# Altium schematic sheet golden_arduino.SchDoc: Golden Arduino Board
size A4; DrawnBy: Rajat Chaple; Revision: 0.0.1; SheetNumber: 1; SheetTotal: 1
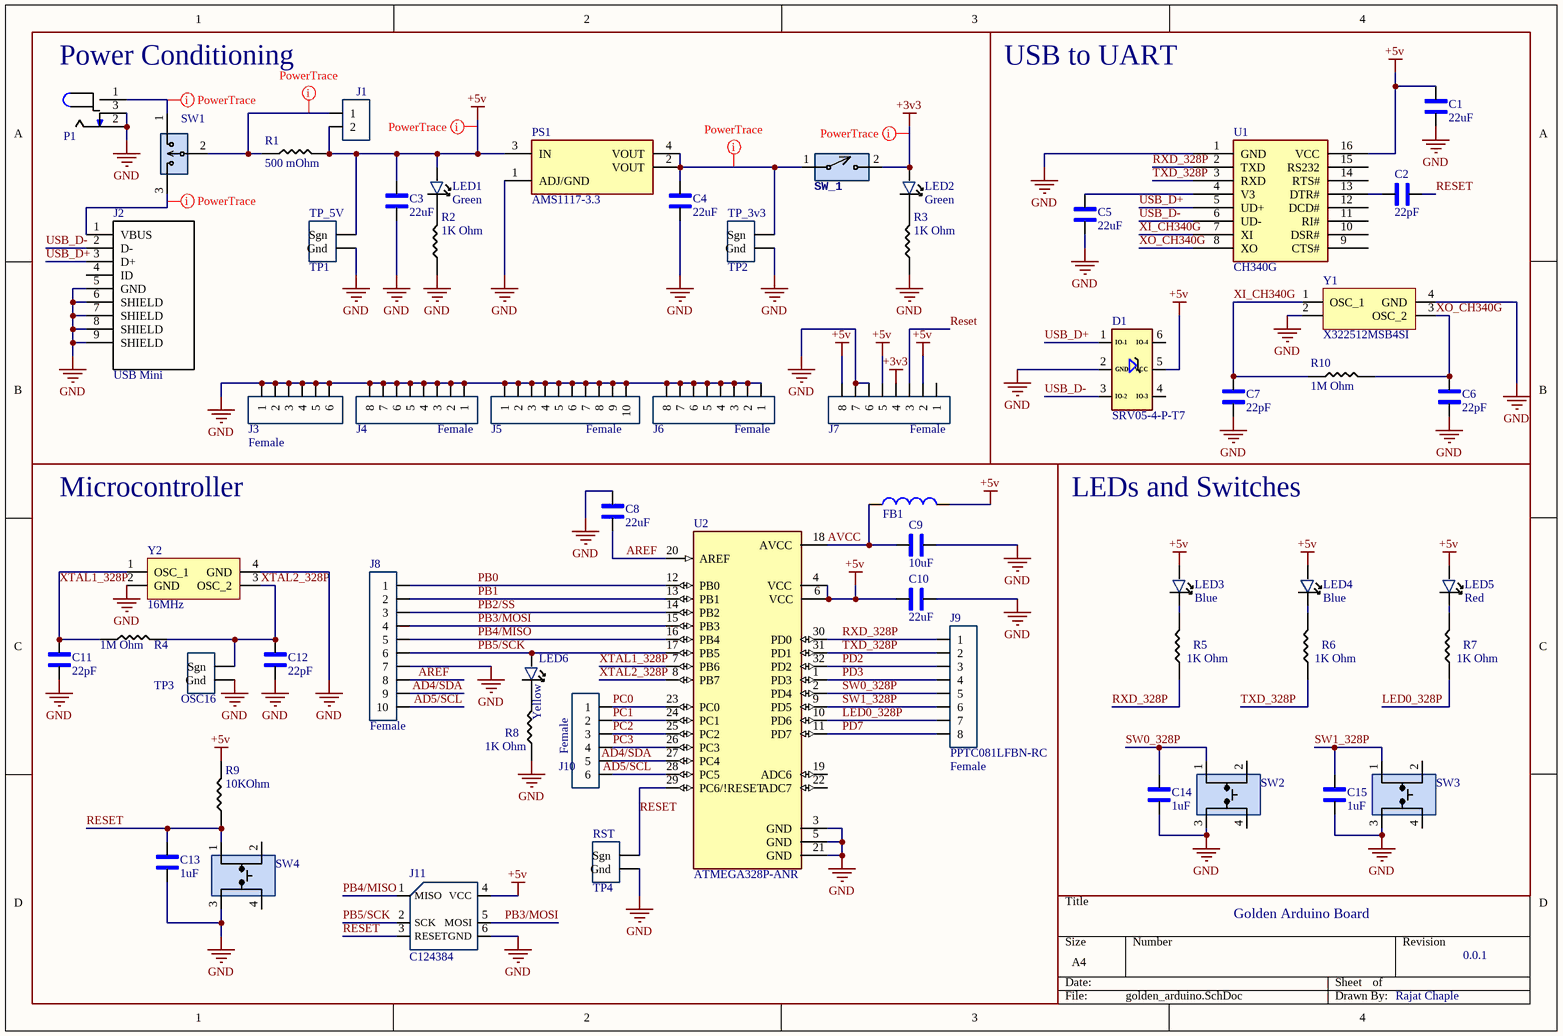
[diagram p0: golden_arduino.SchDoc]

## Parts
C1  22uF  [0805_Passive_Capaciitor]
C2  22pF  [0402_Passive_Capacitor]
C3  22uF  [0805_Passive_Capaciitor]
C4  22uF  [0805_Passive_Capaciitor]
C5  22uF  [0805_Passive_Capaciitor]
C6  22pF  [0402_Passive_Capacitor]
C7  22pF  [0402_Passive_Capacitor]
C8  22uF  [0805_Passive_Capaciitor]
C9  10uF  [0402_Passive_Capacitor]
C10  22uF  [0805_Passive_Capaciitor]
C11  22pF  [0402_Passive_Capacitor]
C12  22pF  [0402_Passive_Capacitor]
C13  1uF  [0402_Passive_Capacitor]
C14  1uF  [0402_Passive_Capacitor]
C15  1uF  [0402_Passive_Capacitor]
D1  SRV05-4-P-T7  [TVS]
FB1  FB_10uH_0603  [0603_PASSIVE_Capacitor]  (value not drawn)
J1  J_2_PIN_HEADER  [2_PIN_100MIL]  (value not drawn)
J2  USB Mini  [USB_MINI_B]
J3  value Female  [6_PIN_ARDUINO_100mil]  (hidden comment: PPTC061LFBN-RC)
J4  value Female  [8_PIN_ARDUINO_100MIL]  (hidden comment: PPTC081LFBN-RC)
J5  value Female  [10_PIN_ARDUINO_100MIL]  (hidden comment: PPTC101LFBN-RC)
J6  value Female  [8_PIN_ARDUINO_100MIL]  (hidden comment: PPTC081LFBN-RC)
J7  value Female  [8_PIN_ARDUINO_100MIL]  (hidden comment: PPTC081LFBN-RC)
J8  value Female  [10_PIN_ARDUINO_100MIL]  (hidden comment: PPTC101LFBN-RC)
J9  PPTC081LFBN-RC  value Female  [8_PIN_ARDUINO_100MIL]
J10  value Female  [6_PIN_ARDUINO_100mil]  (hidden comment: PPTC061LFBN-RC)
J11  LCSC Part#: C124384  [ICSP]  (hidden comment: NRPN032PAEN-RC)
LED1  value Green  [LED_0603]  (hidden comment: KT-0603R)
LED2  value Green  [LED_0603]  (hidden comment: KT-0603R)
LED3  value Blue  [LED_0603]  (hidden comment: KT-0603R)
LED4  value Blue  [LED_0603]  (hidden comment: KT-0603R)
LED5  value Red  [LED_0603]  (hidden comment: KT-0603R)
LED6  value Yellow  [LED_0603]  (hidden comment: KT-0603R)
P1  Power Jack  [Power_Jack]  (value not drawn)
PS1  AMS1117-3.3  [LDO]
R1  value 500 mOhm  [1206_Passive_Resitor]  (hidden comment: 500m)
R2  value 1K Ohm  [0805_Passive_Resistor]  (hidden comment: 1k)
R3  value 1K Ohm  [0805_Passive_Resistor]  (hidden comment: 1k)
R4  value 1M Ohm  [1206_Passive_Resitor]  (hidden comment: 1M)
R5  value 1K Ohm  [0805_Passive_Resistor]  (hidden comment: 1k)
R6  value 1K Ohm  [0805_Passive_Resistor]  (hidden comment: 1k)
R7  value 1K Ohm  [0805_Passive_Resistor]  (hidden comment: 1k)
R8  value 1K Ohm  [0805_Passive_Resistor]  (hidden comment: 1k)
R9  value 10KOhm  [0402_Passive_Resistor]  (hidden comment: 10k)
R10  value 1M Ohm  [1206_Passive_Resitor]  (hidden comment: 1M)
SW1  PREC003SAAN-RC  [3_PIN_100mil]  (value not drawn)
SW2  TL3305AF160QG  [Switch_JLC]  (value not drawn)
SW3  TL3305AF160QG  [Switch_JLC]  (value not drawn)
SW4  TL3305AF160QG  [Switch_JLC]  (value not drawn)
SW_1  SW_2Pin_100mil_Switch  [2Pin-Header-Conn]  (value not drawn)
TP1  TP_5V  [TP10x_Probe]
TP2  TP_3v3  [TP10x_Probe]
TP3  OSC16  [TP10x_Probe]
TP4  RST  [TP10x_Probe]
U1  CH340G  [USB to serial]
U2  ATMEGA328P-ANR  [ATMega328P]
Y1  X322512MSB4SI  [Crystal resonator]
Y2  value 16MHz  [Crystal resonator]  (hidden comment: X322516MLB4SI)

## Blocks framed on the sheet
Power Conditioning: C3 C4 J1-J7 LED1 LED2 P1 PS1 R1-R3 SW1 SW_1 TP1 TP2
USB to UART: C1 C2 C5-C7 D1 R10 U1 Y1
Microcontroller: C8-C13 FB1 J8-J11 LED6 R4 R8 R9 SW4 TP3 TP4 U2 Y2
LEDs and Switches: C14 C15 LED3-LED5 R5-R7 SW2 SW3

## Nets
+3v3: J7.4 LED2.1 SW_1.2
+5v: C1.2 C3.2 C10.2 D1.5(VCC) FB1.2 J1.2 J7.2 J7.5 J7.8 J11.4(VCC) LED1.1 LED3.1 LED4.1 LED5.1 PS1.3(IN) R1.2 R9.2 TP1.1(Sgn) U1.16(VCC) U2.4(VCC) U2.6(VCC)
GND: C1.1 C3.1 C4.1 C5.1 C6.1 C7.1 C8.2 C9.1 C10.1 C11.1 C12.1 C13.1 C14.1 C15.1 D1.2(GND) J2.5(GND) J2.6(SHIELD) J2.7(SHIELD) J2.8(SHIELD) J2.9(SHIELD) J3.1 J3.2 J3.3 J3.4 J3.5 J3.6 J4.1 J4.2 J4.3 J4.4 J4.5 J4.6 J4.7 J4.8 J5.1 J5.2 J5.3 J5.4 J5.5 J5.6 J5.7 J5.8 J5.9 J5.10 J6.1 J6.2 J6.3 J6.4 J6.5 J6.6 J6.7 J6.8 J7.6 J7.7 J8.7 J11.6(GND) P1.2 P1.3 PS1.1(ADJ/GND) R2.1 R3.1 R8.1 SW2.3 SW3.3 SW4.3 TP1.2(Gnd) TP2.2(Gnd) TP3.2(Gnd) TP4.2(Gnd) U1.1(GND) U2.3(GND) U2.5(GND) U2.21(GND) Y1.2 Y1.4(GND) Y2.2(GND) Y2.4(GND)
AD4/SDA: J8.9 J10.5 U2.27(PC4)
AD5/SCL: J8.10 J10.6 U2.28(PC5)
AREF: C8.1 J8.8 U2.20(AREF)
AVCC: C9.2 FB1.1 U2.18(AVCC)
LED0_328P: J9.7 R7.1 U2.10(PD6)
PB0: J8.1 U2.12(PB0)
PB1: J8.2 U2.13(PB1)
PB2/SS: J8.3 U2.14(PB2)
PB3/MOSI: J8.4 J11.5(MOSI) U2.15(PB3)
PB4/MISO: J8.5 J11.1(MISO) U2.16(PB4)
PB5/SCK: J8.6 J11.2(SCK) LED6.1 U2.17(PB5)
PC0: J10.1 U2.23(PC0)
PC1: J10.2 U2.24(PC1)
PC2: J10.3 U2.25(PC2)
PC3: J10.4 U2.26(PC3)
PD2: J9.3 U2.32(PD2)
PD3: J9.4 U2.1(PD3)
PD7: J9.8 U2.11(PD7)
RESET: C2.2 C13.2 J7.3 J11.3(RESET) R9.1 SW4.1 TP4.1(Sgn) U2.29(PC6/!RESET)
RXD_328P: J9.1 R5.1 U1.2(TXD) U2.30(PD0)
SW0_328P: C14.2 J9.5 SW2.1 U2.2(PD4)
SW1_328P: C15.2 J9.6 SW3.1 U2.9(PD5)
TXD_328P: J9.2 R6.1 U1.3(RXD) U2.31(PD1)
USB_D+: D1.1(IO-1) J2.3(D+) U1.5(UD+)
USB_D-: D1.3(IO-2) J2.2(D-) U1.6(UD-)
XI_CH340G: C7.2 R10.1 U1.7(XI) Y1.1(OSC_1)
XO_CH340G: C6.2 R10.2 U1.8(XO) Y1.3(OSC_2)
XTAL1_328P: C11.2 R4.1 U2.7(PB6) Y2.1(OSC_1)
XTAL2_328P: C12.2 R4.2 TP3.1(Sgn) U2.8(PB7) Y2.3(OSC_2)
NetC2_1: C2.1 U1.13(DTR#)
NetC4_2: C4.2 PS1.2(VOUT) PS1.4(VOUT) SW_1.1 TP2.1(Sgn)
NetC5_2: C5.2 U1.4(V3)
NetJ1_1: J1.1 R1.1 SW1.2
NetJ2_1: J2.1(VBUS) SW1.3
NetLED1_2: LED1.2 R2.2
NetLED2_2: LED2.2 R3.2
NetLED3_2: LED3.2 R5.2
NetLED4_2: LED4.2 R6.2
NetLED5_2: LED5.2 R7.2
NetLED6_2: LED6.2 R8.2
NetP1_1: P1.1 SW1.1

Not connected (* = marked no-connect by the designer): D1 4(IO-3) 6(IO-4); J2 4(ID); J7 1; SW2 2 4; SW3 2 4; SW4 2 4; U1 9(CTS#) 10(DSR#) 11(RI#) 12(DCD#) 14(RTS#) 15(RS232); U2 19(ADC6) 22(ADC7)

## Layout directives
rule Width Constraint [Pref Width = 20mil    Min Width = 10mil    Max Width = 100mil]: +3v3, +5v, NetC4_2, NetJ1_1, NetJ2_1, NetP1_1

## Library data of the parts
C1 C3-C5 C8 C10 = C_22uF_0805: MULTILAYER CERAMIC CAPACITORS MLCC - SMD/SMT 22UF 25V 0805 ROHS; MFR Part #: CL21A226MAQNNNE; Type: Basic; Datasheet: https://datasheet.lcsc.com/szlcsc/Samsung-Electro-Mechanics-CL21A226MAQNNNE_C45783.pdf; LCSC Part#: C45783; Value: 22uF
C2 C6 C7 C11 C12 = C_22pF_0402: MULTILAYER CERAMIC CAPACITORS MLCC - SMD/SMT 22PF 50V 0402 ROHS; MFR Part #: 0402CG220J500NT; Type: Basic; Datasheet: https://datasheet.lcsc.com/szlcsc/Guangdong-Fenghua-Advanced-Tech-0402CG220J500NT_C1555.pdf; LCSC Part#: C1555; Value: 22pF
C9 = C_10uF_0402: 10uF ±20% 6.3V X5R 0402 Multilayer Ceramic Capacitors MLCC - SMD/SMT RoHS; MFR Part #: CL05A106MQ5NUNC; Type: Basic; LCSC Part#: C15525; Datasheet: https://datasheet.lcsc.com/lcsc/1810191215_Samsung-Electro-Mechanics-CL05A106MQ5NUNC_C15525.pdf; Value: 10uF
C13-C15 = C_1uF_0402: MULTILAYER CERAMIC CAPACITORS MLCC - SMD/SMT 1UF 25V 0402 ROHS; MFR Part #: CL05A105KA5NQNC; Type: Basic; Datasheet: https://datasheet.lcsc.com/szlcsc/Samsung-Electro-Mechanics-CL05A105KA5NQNC_C52923.pdf; LCSC Part#: C52923; Value: 1uF
D1 = D_TVS_Diode: TVS SOT-23-6 ROHS; Value: TVS DIODE 5.5V 6TSOP; Type: Basic; MFR Part #: SRV05-4-P-T7; LCSC Part#: C85364; Datasheet: https://datasheet.lcsc.com/szlcsc/ProTek-Devices-SRV05-4-P-T7_C85364.pdf
FB1 = FB_10uH_0603: 10 uH, 30 Q, 1.85 Ohm Series Resistance, 17MHz Self Resonant Frequency,Inductor , SMD 0603, 3 Amps rated current; MFR Part #: SDFL1608S100KTF; Type: Basic; Datasheet: https://datasheet.lcsc.com/szlcsc/Sunlord-SDFL1608S100KTF_C1035.pdf; LCSC Part#: C1035
J1 = J_2_PIN_HEADER: 2 Position Header Connector 0.100" (2.54mm) Through Hole Tin
J2 = J_USB_B_Mini: Through Hole USB Connectors RoHS; MFR Part #: 920-462A2021D10102; Value: USB mini B; LCSC Part#: C46398; Datasheet: https://datasheet.lcsc.com/szlcsc/2103081233_Jing-Extension-of-the-Electronic-Co-920-462A2021D10102_C46398.pdf; Type: Extended
J3 J10 = JF_6_PIN_FEMALE_ARDUINO: 6 Position Header Connector 0.100" (2.54mm) Through Hole Tin; Digikey Link: https://www.digikey.com/product-detail/en/PPTC061LFBN-RC/S7004-ND/810145/?itemSeq=304982353; Digikey Part: S7004-ND; LCSC Part#: C40877; Type: Extended
J4 J6 J7 J9 = JF_8_PIN_FEMALE_ARDUINO: 8 Position Header Connector 0.100" (2.54mm) Through Hole Tin; Digikey Link: https://www.digikey.com/product-detail/en/PPTC081LFBN-RC/S7006-ND/810147/?itemSeq=304982354; Digikey Part: S7006-ND; Type: Extended; LCSC Part#: C27438
J5 J8 = JF_10_PIN_FEMALE_ARDUINO: 10 Position Header Connector 0.100" (2.54mm) Through Hole Tin; Digikey Link: https://www.digikey.com/product-detail/en/PPTC101LFBN-RC/S7008-ND/810149/?itemSeq=304982352; Digikey Part: S7008-ND; LCSC Part#: C225507; Type: Extended
J11 = J_ICSP: Connector Header Through Hole 6 position 0.079" (2.00mm); Digikey Link: https://www.digikey.com/product-detail/en/NRPN032PAEN-RC/S5801-03-ND/804955/?itemSeq=304982355; Digikey Part: S5801-03-ND; Value: NRPN032PAEN-RC; Type: Extended
LED1 LED2 = LED_GREEN_0603: LIGHT EMITTING DIODES (LED) GREEN 520~535NM 112~258MCD@20MA TOP VIEW 0603 ROHS; MFR Part #: 19-217/GHC-YR1S2/3T; Type: Basic; LCSC Part#: C72043
LED3 LED4 = LED_BLUE_0603: LIGHT EMITTING DIODES (LED) BLUE 465~475NM 11.5~28.5MCD@5MA TOP VIEW 0603 ROHS; MFR Part #: 19-217/BHC-ZL1M2RY/3T; Type: Basic; LCSC Part#: C72041
LED5 = LED_RED_0603: LIGHT EMITTING DIODES (LED) RED 520~625NM 90~100MCD@20MA TOP VIEW 0603 ROHS; Type: Basic; Datasheet: https://datasheet.lcsc.com/szlcsc/Everlight-Elec-19-217-BHC-ZL1M2RY-3T_C72041.pdf; MFR Part #: KT-0603R; LCSC Part#: C2286
LED6 = LED_YELLOW_0603: LIGHT EMITTING DIODES (LED) YELLOW 585.5~591.5NM 90~180MCD@20MA TOP VIEW 0603 ROHS; MFR Part #: 19-213/Y2C-CQ2R2L/3T(CY); Type: Basic; Datasheet: https://datasheet.lcsc.com/szlcsc/Everlight-Elec-19-217-BHC-ZL1M2RY-3T_C72041.pdf; LCSC Part#: C72038
P1 = P_Power Jack: Power Barrel Connector Jack 2.10mm ID (0.083"), 5.50mm OD (0.217") Through Hole, Right Angle; Value: CONN PWR JACK 2X5.5MM SOLDER; Digikey Link: https://www.digikey.com/product-detail/en/PJ-102A/CP-102A-ND/275425/?itemSeq=304982367; Digikey Part: CP-102A-ND; LCSC Part#: C136744; Type: Extended
PS1 = PS_AMS_LDO_3v3: LOW DROPOUT REGULATORS(LDO) POSITIVE FIXED 1.3V @ 800MA 15V 3.3V 1A SOT-223 ROHS; Value: IC REG LINEAR 3.3V 800MA SOT223; MFR Part #: AMS1117-3.3; LCSC Part#: C6186; Type: Basic
R1 = R_500m_1206: CHIP RESISTOR - SURFACE MOUNT 10.5OHMS ±1% 1/4W 1206 ROHS; MFR Part #: 1206W4F105JT5E; Datasheet: https://datasheet.lcsc.com/szlcsc/SUP-MRMF3216-1206-LR005FTN_C76290.pdf
R2 R3 R5-R8 = R_1K_0805: CHIP RESISTOR - SURFACE MOUNT 1KOHMS ±1% 1/8W 0805 ROHS; MFR Part #: 0805W8F1001T5E; LCSC Part#: C17513; Type: Basic
R4 R10 = R_1M_1206: CHIP RESISTOR - SURFACE MOUNT 1MOHMS ±1% 1/4W 1206 ROHS; Digikey Link: https://www.digikey.com/product-detail/en/RMCF1206JT1M00/RMCF1206JT1M00CT-ND/1942830/?itemSeq=304982358; Digikey Part: Number RMCF1206JT1M00CT-ND; LCSC Part#: C17927; Type: Basic
R9 = R_10KOhm_0402: CHIP RESISTOR - SURFACE MOUNT 10KOHMS ±1% 1/16W 0402 ROHS; MFR Part #: 0402WGF1002TCE; Datasheet: https://datasheet.lcsc.com/szlcsc/Uniroyal-Elec-0402WGF1002TCE_C25744.pdf; LCSC Part#: C25744; Type: Basic
SW1 = SW_3Pin_100mil_Switch: Connector Header Through Hole 3 position 0.100" (2.54mm); Value: CONN HEADER VERT 3POS 2.54MM; Digikey Link: https://www.digikey.com/product-detail/en/PREC003SAAN-RC/S1012EC-03-ND/2774851/?itemSeq=304982371; Digikey Part: S1012EC-03-ND; Type: Extended; LCSC Part#: C429954
SW2-SW4 = SW_Push_Button_JLC: Tactile Switch SPST-NO Top Actuated Surface Mount; MFR Part #: C174049; LCSC Part#: C174049; Type: Extended
SW_1 = SW_2Pin_100mil_Switch: 2Pin Header; LCSC Part#: C124375; Type: Extended
TP1-TP4 = TP_10x_Probe: Test Point 300 mil centers
U1 = U_USBtoSerial: Transceiver USB 2.0 2Mbps SOP-16_150mil USB ICs RoHS; Datasheet: https://datasheet.lcsc.com/lcsc/2008191806_WCH-Jiangsu-Qin-Heng-CH340G_C14267.pdf; LCSC Part#: C14267; MFR Part #: CH340G; Type: Basic; Value: USB to Serial
U2 = U_ATMega328P: AVR AVR® ATmega Microcontroller IC 8-Bit 20MHz 32KB (16K x 16) FLASH 32-TQFP (7x7); MFR Part #: ATMEGA328P-AU; Value: IC MCU 8BIT 32KB FLASH 32TQFP; Digikey Link: https://www.digikey.com/product-detail/en/ATMEGA328P-ANR/ATMEGA328P-ANRCT-ND/2774230/?itemSeq=304982365; LCSC Part#: C14877; Type: Basic
Y1 = X_12MHz_Res: SMD Crystal Resonators 12MHz ±10ppm SMD-3225_4P RoHS; LCSC Part#: C9002; MFR Part #: X322512MSB4SI; Value: 12MHz; Type: Basic; Datasheet: https://datasheet.lcsc.com/szlcsc/Yangxing-Tech-X322512MSB4SI_C9002.pdf
Y2 = X_16Mhz_Res: ±10ppm 16000000Hz -40℃~85℃ 贴片无源晶振 60Ω 9pF SMD3225-4P Crystals ROHS; LCSC Part#: C13738; MFR Part #: X322516MLB4SI; Type: Basic